# EasyEDA schematic SCH_ESP32-LSHT-M-H-Project-Folder_2024-06-17.json
TITLE: ESP32-LSHT-M-H; REV: 0.2; Date: 2024-06-17; Sheet: 1/1; Drawn By: IanR; Company: CSD - Open Source
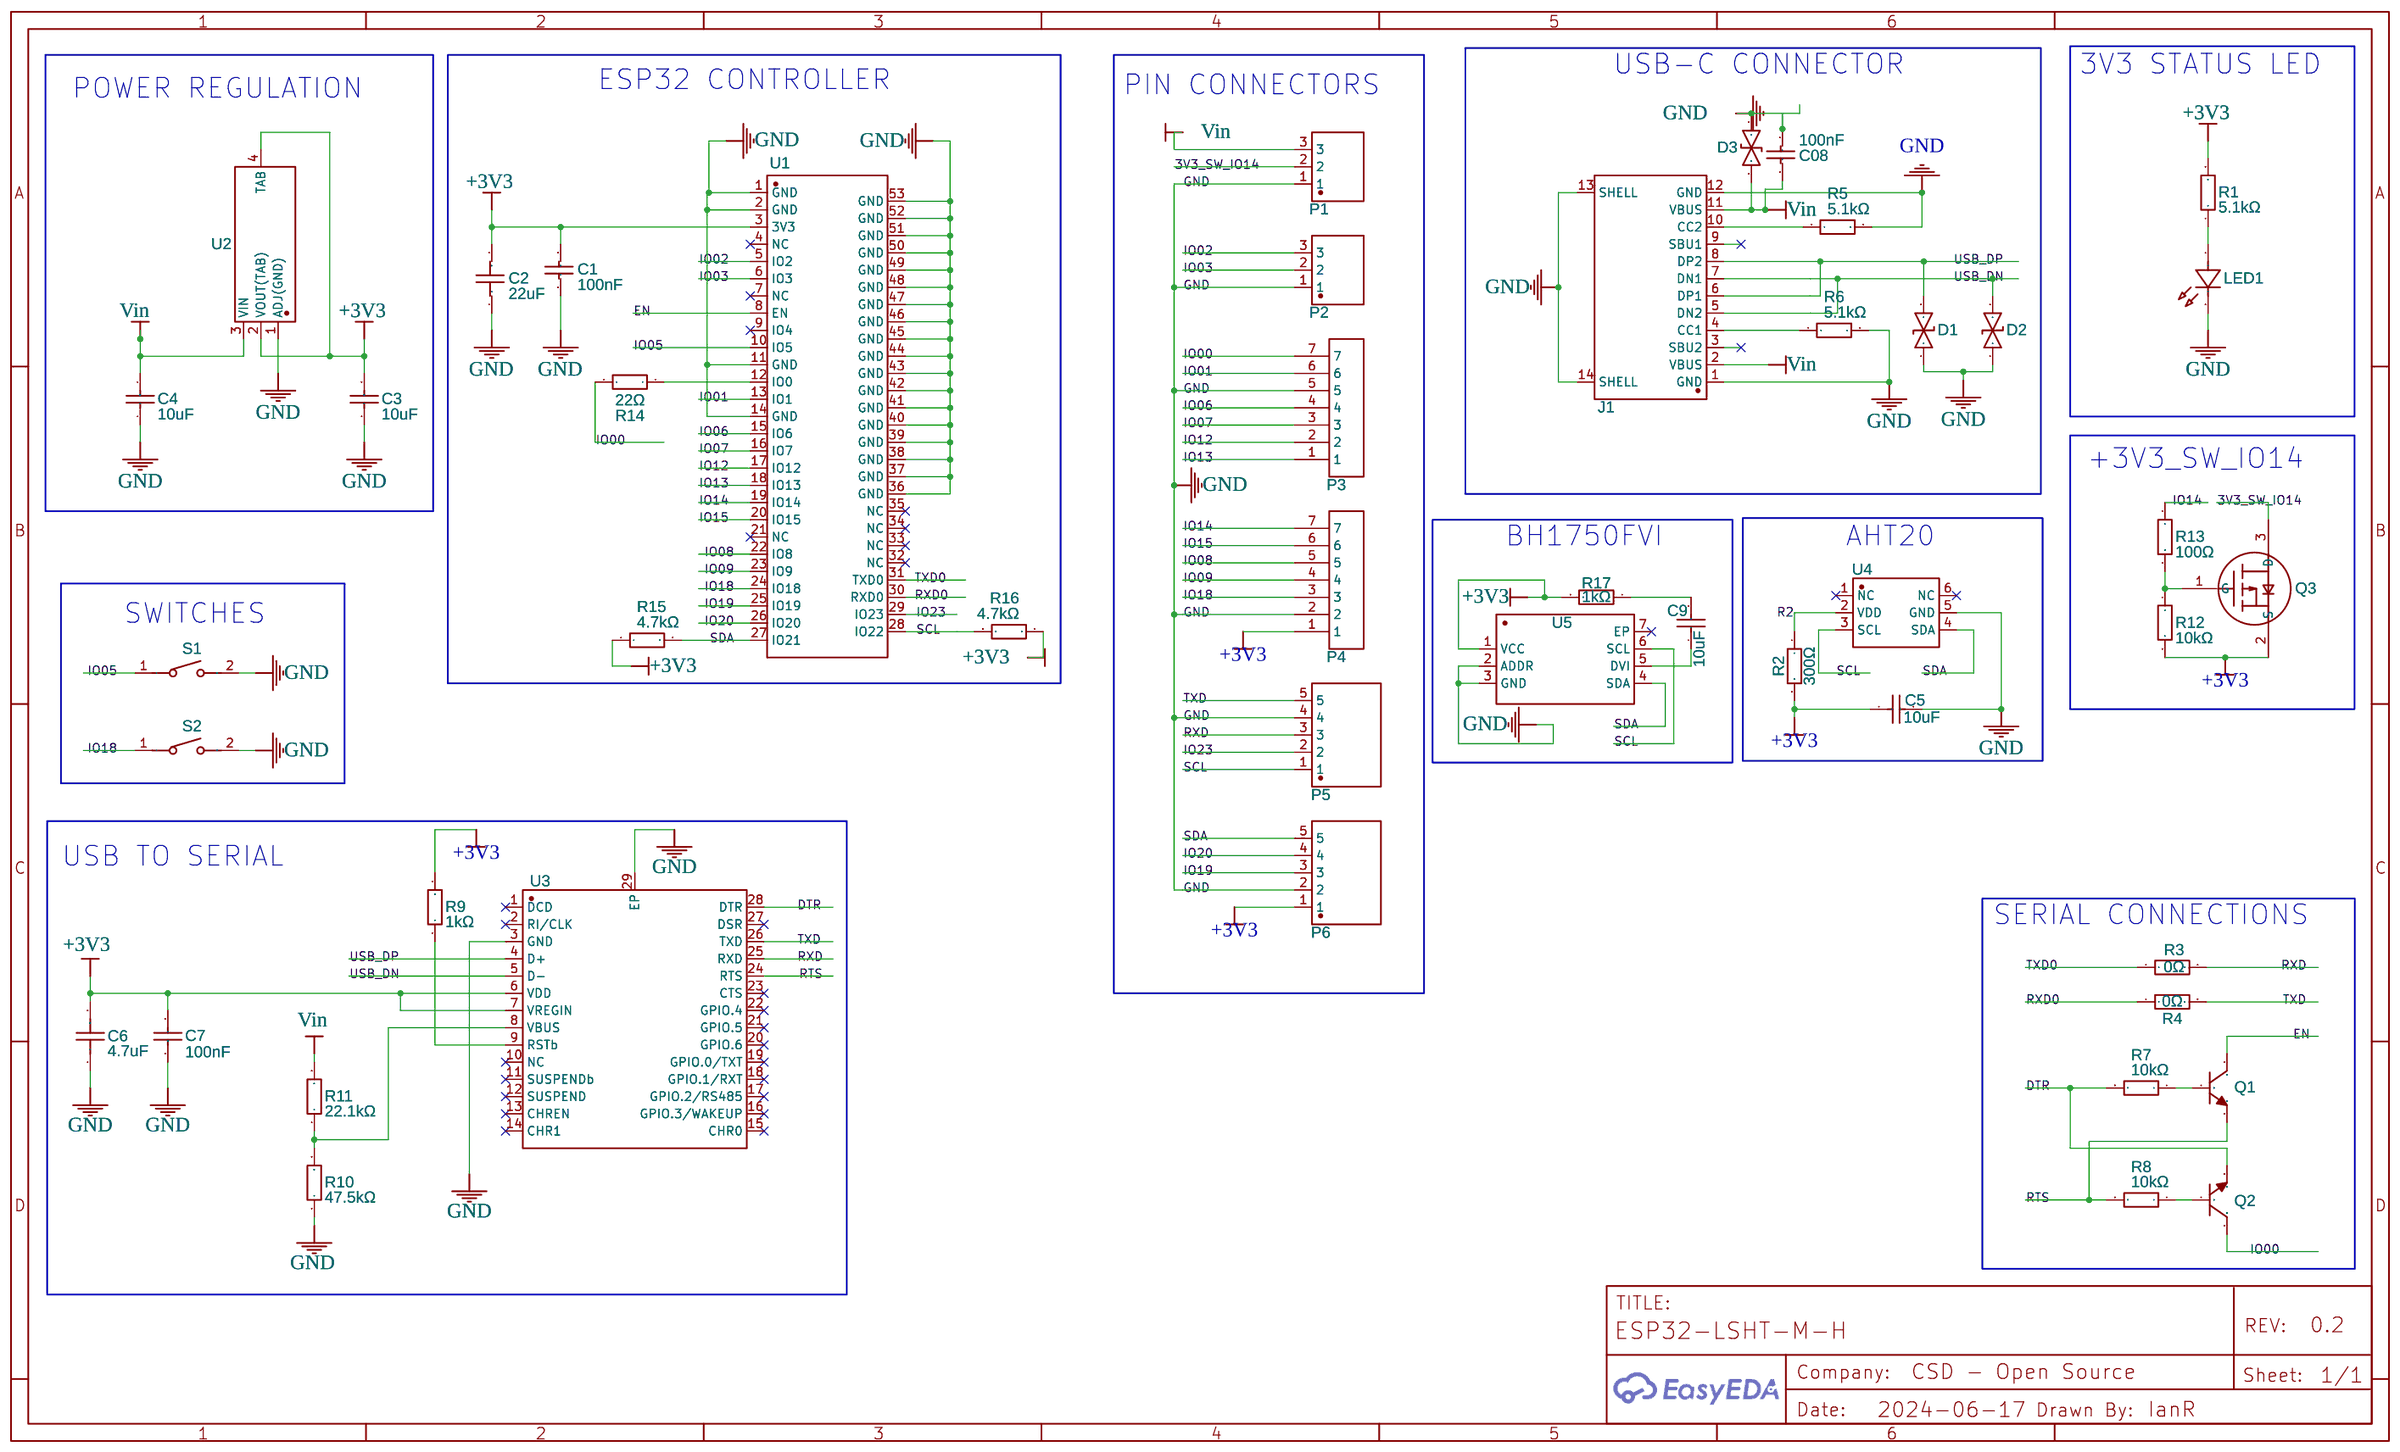
[diagram p0: schematic sheet]

## Parts
C1  100nF  [C0402]
C2  22uF  [C0402]
C3  10uF  [C0402]
C4  10uF  [C0402]
C5  10uF  [C0402]
C6  4.7uF  [C0402]
C7  100nF  [C0402]
C08  100nF  [C0402]
C9  10uF  [C0402]
D1  LESD5D5.0CT1G_C5246195  [SOD-523_L1.2-W0.8-LS1.6-BI]
D2  LESD5D5.0CT1G_C5246195  [SOD-523_L1.2-W0.8-LS1.6-BI]
D3  LESD5D5.0CT1G_C5246195  [SOD-523_L1.2-W0.8-LS1.6-BI]
J1  TYPE-C 16PIN 2MD(073)  [USB-C-SMD_TYPE-C-6PIN-2MD-073]
LED1  XL-1005SURC  [LED0402-R-RD_RED]
P1  B3B-ZR-(LF)(SN)  [CONN-TH_B3B-ZR]
P2  B3B-ZR-(LF)(SN)  [CONN-TH_B3B-ZR]
P3  B7B-ZR (LF)(SN)  [CONN-TH-7P-P1.50_B7B-ZR-LF-SN]
P4  B7B-ZR (LF)(SN)  [CONN-TH-7P-P1.50_B7B-ZR-LF-SN]
P5  B5B-ZR-(LF)(SN)  [CONN-TH_5P-P1.50_B5B-ZR-LF-SN]
P6  B5B-ZR-(LF)(SN)  [CONN-TH_5P-P1.50_B5B-ZR-LF-SN]
Q1  SS8050-G  [SOT-23-3_L2.9-W1.3-P1.90-LS2.4-BR]
Q2  SS8050-G  [SOT-23-3_L2.9-W1.3-P1.90-LS2.4-BR]
Q3  SI2333DS-T1-E3  [SOT-23_L2.9-W1.3-P1.90-LS2.4-BR]
R1  5.1kΩ  [R0402]
R2  300Ω  [R0402]
R3  0Ω  [R0402]
R4  0Ω  [R0402]
R5  5.1kΩ  [R0402]
R6  5.1kΩ  [R0402]
R7  10kΩ  [R0402]
R8  10kΩ  [R0402]
R9  1kΩ  [R0402]
R10  47.5kΩ  [R0402]
R11  22.1kΩ  [R0402]
R12  10kΩ  [R0402]
R13  100Ω  [R0402]
R14  22Ω  [R0402]
R15  4.7kΩ  [R0402]
R16  4.7kΩ  [R0402]
R17  1kΩ  [R0402]
S1  TS-1088-AR02016  [SW-SMD_L3.9-W3.0-P4.45]
S2  TS-1088-AR02016  [SW-SMD_L3.9-W3.0-P4.45]
U1  ESP32-C6-MINI-1-N4  [WIFIM-SMD_61P-L16.6-W13.2-P0.80-ESP32-C6-MINI-1-N4]
U2  AMS1117-3.3_C347222  [SOT-223-4_L6.5-W3.5-P2.30-LS7.0-BR]
U3  CP2102N-A02-GQFN28R  [QFN-28_L5.0-W5.0-P0.50-TL-EP3.3]
U4  AHT20_C2757850  [SENSOR-SMD_L3.0-W3.0-P1.00-BR]
U5  BH1750FVI-TR  [WSOF-6_L2.6-W1.6-P0.50-TL-EP]

## Library data of the parts
C1 C7 C08 = CL05B104KO5NNNC: Supplier: LCSC; Manufacturer: SAMSUNG(三星); Supplier Part: C1525; JLCPCB Part Class: Basic Part
C2 = GRM158R61A226ME15D: Supplier: LCSC; Supplier Part: C3845593; Manufacturer: muRata(村田); JLCPCB Part Class: Extended Part; Contributor: lcsc
C3-C5 C9 = CL05A106MQ5NUNC: Supplier: LCSC; Manufacturer: SAMSUNG(三星); Supplier Part: C15525; JLCPCB Part Class: Basic Part
C6 = CL05A475KP5NRNC: Contributor: LCSC; Supplier: LCSC; Supplier Part: C368809; Manufacturer: SAMSUNG(三星); JLCPCB Part Class: Extended Part
D1 D2 = LESD5D5.0CT1G_C5246195: Contributor: lcsc; Supplier: LCSC; Supplier Part: C5246195; Manufacturer: Leiditech(雷卯电子); Manufacturer Part: LESD5D5.0CT1G
D3 = LESD5D5.0CT1G_C5246195: Contributor: lcsc; Supplier: LCSC; Supplier Part: C5246195; Manufacturer: Leiditech(雷卯电子); Manufacturer Part: LESD5D5.0CT1G; Package Display: No
J1 = TYPE-C 16PIN 2MD(073): Contributor: LCSC; Supplier: LCSC; Supplier Part: C2765186; Manufacturer: SHOU HAN(首韩); JLCPCB Part Class: Extended Part
LED1 = XL-1005SURC: Contributor: LCSC; Supplier: LCSC; Supplier Part: C965790; Manufacturer: XINGLIGHT(成兴光); JLCPCB Part Class: Extended Part
P1 P2 = B3B-ZR-(LF)(SN): Contributor: LCSC; Supplier: LCSC; Supplier Part: C158001; Manufacturer: JST; Manufacturer Part: B3B-ZR(LF)(SN); JLCPCB Part Class: Extended Part
P3 P4 = B7B-ZR (LF)(SN): Contributor: LCSC; Supplier: LCSC; Supplier Part: C157978; Manufacturer: JST; Manufacturer Part: B7B-ZR(LF)(SN); JLCPCB Part Class: Extended Part
P5 P6 = B5B-ZR-(LF)(SN): Contributor: LCSC; Supplier: LCSC; Supplier Part: C157990; Manufacturer: JST; Manufacturer Part: B5B-ZR(LF)(SN); JLCPCB Part Class: Extended Part
Q1 Q2 = SS8050-G: Contributor: LCSC; Supplier: LCSC; Manufacturer: CJ(江苏长电/长晶); Supplier Part: C164886; JLCPCB Part Class: Extended Part
Q3 = SI2333DS-T1-E3: Contributor: LCSC; Supplier: LCSC; Manufacturer: VISHAY(威世); Supplier Part: C142520; JLCPCB Part Class: Extended Part
R1 R5 R6 = 0402WGF5101TCE: Supplier: LCSC; Manufacturer: UNI-ROYAL(厚声); Supplier Part: C25905; JLCPCB Part Class: Basic Part
R2 = RC0402FR-07300RL: Supplier: LCSC; Manufacturer: YAGEO(国巨); Supplier Part: C138010; JLCPCB Part Class: Extended Part
R3 R4 = 0402WGF0000TCE: Supplier: LCSC; Manufacturer: UNI-ROYAL(厚声); Supplier Part: C17168; JLCPCB Part Class: Basic Part
R7 R8 R12 = 0402WGF1002TCE: Supplier: LCSC; Manufacturer: UNI-ROYAL(厚声); Supplier Part: C25744; JLCPCB Part Class: Basic Part
R9 R17 = 0402WGF1001TCE: Supplier: LCSC; Manufacturer: UNI-ROYAL(厚声); Supplier Part: C11702; JLCPCB Part Class: Basic Part
R10 = 0402WGF4752TCE: Supplier: LCSC; Manufacturer: UNI-ROYAL(厚声); Supplier Part: C25896; JLCPCB Part Class: Extended Part
R11 = 0402WGF2212TCE: Supplier: LCSC; Manufacturer: UNI-ROYAL(厚声); Supplier Part: C43473; JLCPCB Part Class: Extended Part
R13 = RC0402FR-07100RL: Supplier: LCSC; Manufacturer: YAGEO(国巨); Supplier Part: C106232; JLCPCB Part Class: Extended Part
R14 = 0402WGF220JTCE: Supplier: LCSC; Manufacturer: UNI-ROYAL(厚声); Supplier Part: C25092; JLCPCB Part Class: Basic Part
R15 R16 = 0402WGF4701TCE: Supplier: LCSC; Manufacturer: UNI-ROYAL(厚声); Supplier Part: C25900; JLCPCB Part Class: Basic Part
S1 S2 = TS-1088-AR02016: Contributor: LCSC; Supplier: LCSC; Supplier Part: C720477; Manufacturer: XUNPU(讯普); JLCPCB Part Class: Extended Part
U1 = ESP32-C6-MINI-1-N4: Supplier: LCSC; Supplier Part: C5736265; Manufacturer: ESPRESSIF(乐鑫); Contributor: lcsc; JLCPCB Part Class: Extended Part
U2 = AMS1117-3.3_C347222: Contributor: LCSC; Supplier: LCSC; Supplier Part: C347222; Manufacturer: UMW(友台半导体); Manufacturer Part: AMS1117-3.3; JLCPCB Part Class: Extended Part
U3 = CP2102N-A02-GQFN28R: Contributor: LCSC; Supplier: LCSC; Supplier Part: C964632; Manufacturer: SKYWORKS/SILICON LABS(芯科); JLCPCB Part Class: Extended Part
U4 = AHT20_C2757850: Contributor: LCSC; Supplier: LCSC; Supplier Part: C2757850; Manufacturer: 广州奥松; Manufacturer Part: AHT20; JLCPCB Part Class: Extended Part
U5 = BH1750FVI-TR: Supplier: LCSC; Manufacturer: ROHM(罗姆); Supplier Part: C78960; JLCPCB Part Class: Extended Part

## Nets
3V3_SW_IO14: P1.2 Q3.3(D)
+3V3: C1.2 C2.2 C3.2 C5.1 C6.2 C7.2 P4.1 P6.1 Q3.2(S) R1.2 R2.2 R9.2 R12.2 R15.1 R16.1 R17.2 U1.3(3V3) U2.2(VOUT(TAB)) U2.4(TAB) U3.6(VDD) U3.7(VREGIN) U5.1(VCC)
GND: C1.1 C2.1 C3.1 C4.1 C5.2 C6.1 C7.1 C08.1 D1.1 D2.1 D3.1 J1.1(GND) J1.12(GND) J1.13(SHELL) J1.14(SHELL) LED1.2(A) P1.1 P2.1 P3.5 P4.2 P5.4 P6.2 R5.2 R6.2 R10.1 S1.2 S2.2 U1.1(GND) U1.2(GND) U1.11(GND) U1.14(GND) U1.36(GND) U1.37(GND) U1.38(GND) U1.39(GND) U1.40(GND) U1.41(GND) U1.42(GND) U1.43(GND) U1.44(GND) U1.45(GND) U1.46(GND) U1.47(GND) U1.48(GND) U1.49(GND) U1.50(GND) U1.51(GND) U1.52(GND) U1.53(GND) U2.1(ADJ(GND)) U3.3(GND) U3.29(EP) U4.5(GND) U5.2(ADDR) U5.3(GND)
Vin: C4.2 C08.2 D3.2 J1.2(VBUS) J1.11(VBUS) P1.3 R11.2 U2.3(VIN)
DTR: Q2.2(E) R7.2 U3.28(DTR)
EN: Q1.3(C) U1.8(EN)
IO00: P3.7 Q2.3(C) R14.2
IO01: P3.6 U1.13(IO1)
IO02: P2.3 U1.5(IO2)
IO03: P2.2 U1.6(IO3)
IO05: S1.1 U1.10(IO5)
IO06: P3.4 U1.15(IO6)
IO07: P3.3 U1.16(IO7)
IO08: P4.5 U1.22(IO8)
IO09: P4.4 U1.23(IO9)
IO12: P3.2 U1.17(IO12)
IO13: P3.1 U1.18(IO13)
IO14: P4.7 R13.1 U1.19(IO14)
IO15: P4.6 U1.20(IO15)
IO18: P4.3 S2.1 U1.24(IO18)
IO19: P6.3 U1.25(IO19)
IO20: P6.4 U1.26(IO20)
IO23: P5.2 U1.29(IO23)
R2: R2.1 U4.2(VDD)
RTS: Q1.2(E) R8.2 U3.24(RTS)
RXD: P5.3 R3.2 U3.25(RXD)
RXD0: R4.1 U1.30(RXD0)
SCL: P5.1 R16.2 U1.28(IO22) U4.3(SCL) U5.6(SCL)
SDA: P6.5 R15.2 U1.27(IO21) U4.4(SDA) U5.4(SDA)
TXD: P5.5 R4.2 U3.26(TXD)
TXD0: R3.1 U1.31(TXD0)
USB_DN: D2.2 J1.5(DN2) J1.7(DN1) U3.5(D-)
USB_DP: D1.2 J1.6(DP1) J1.8(DP2) U3.4(D+)
Net-(C9-1): C9.1 U5.5(DVI)
Net-(C9-2): C9.2 R17.1
Net-(J1-4): J1.4(CC1) R6.1
Net-(J1-10): J1.10(CC2) R5.1
Net-(LED1-1): LED1.1(K) R1.1
Net-(Q1-1): Q1.1(B) R7.1
Net-(Q2-1): Q2.1(B) R8.1
Net-(Q3-1): Q3.1(G) R12.1 R13.2
Net-(R9-1): R9.1 U3.9(RSTb)
Net-(R10-2): R10.2 R11.1 U3.8(VBUS)
Net-(R14-1): R14.1 U1.12(IO0)

Not connected (* = marked no-connect by the designer): J1 3(SBU2) 9(SBU1); U1 4(NC)* 7(NC)* 9(IO4)* 21(NC)* 32(NC)* 33(NC)* 34(NC)* 35(NC)*; U3 1(DCD)* 2(RI/CLK)* 10(NC)* 11(SUSPENDb)* 12(SUSPEND)* 13(CHREN)* 14(CHR1)* 15(CHR0)* 16(GPIO.3/WAKEUP)* 17(GPIO.2/RS485)* 18(GPIO.1/RXT)* 19(GPIO.0/TXT)* 20(GPIO.6)* 21(GPIO.5)* 22(GPIO.4)* 23(CTS)* 27(DSR)*; U4 1(NC)* 6(NC)*; U5 7(EP)*

## Notes on the sheet
- USB-C CONNECTOR
- 3V3 STATUS LED
- POWER REGULATION
- ESP32 CONTROLLER
- PIN CONNECTORS
- +3V3_SW_IO14
- BH1750FVI
- AHT20
- SWITCHES
- USB TO SERIAL
- SERIAL CONNECTIONS
